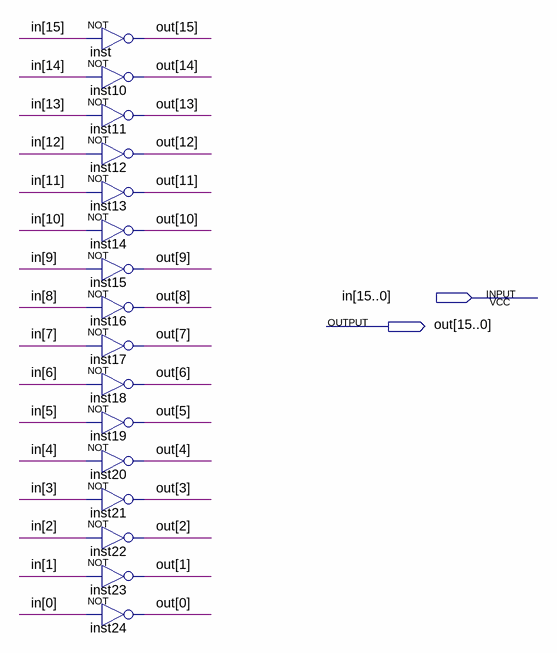
[diagram p0: schematic sheet]
// Quartus schematic not_16_bits.bdf as structural Verilog: 16 symbols, 2 pins
module not_16_bits (
  input  [15:0] in,
  output [15:0] out
);

  not inst (out[15], in[15]);
  not inst10 (out[14], in[14]);
  not inst11 (out[13], in[13]);
  not inst12 (out[12], in[12]);
  not inst13 (out[11], in[11]);
  not inst14 (out[10], in[10]);
  not inst15 (out[9], in[9]);
  not inst16 (out[8], in[8]);
  not inst17 (out[7], in[7]);
  not inst18 (out[6], in[6]);
  not inst19 (out[5], in[5]);
  not inst20 (out[4], in[4]);
  not inst21 (out[3], in[3]);
  not inst22 (out[2], in[2]);
  not inst23 (out[1], in[1]);
  not inst24 (out[0], in[0]);
endmodule
